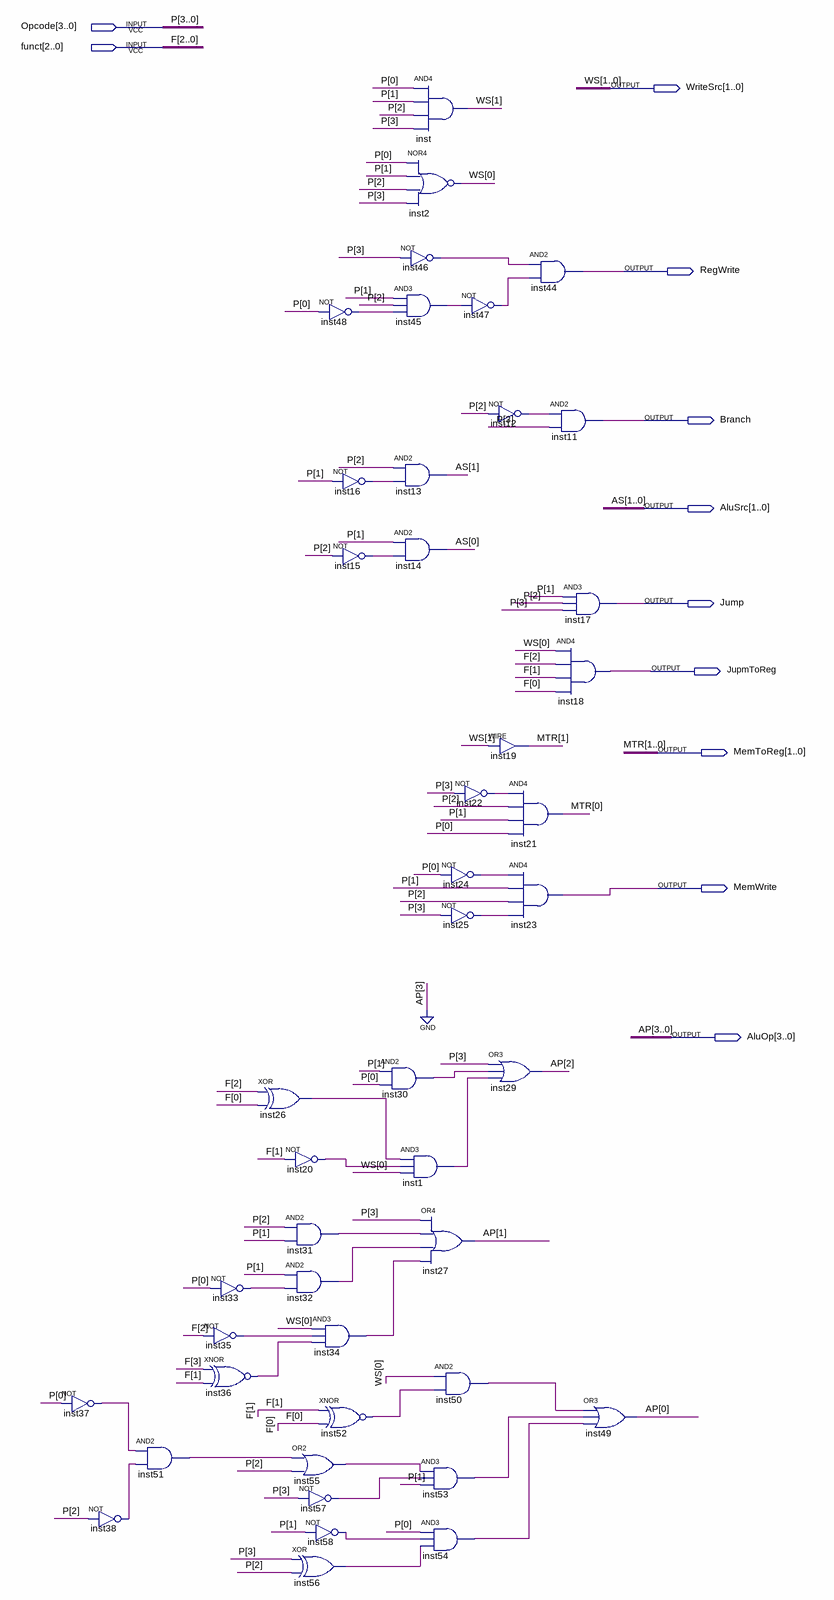
[diagram p0: schematic sheet]
// Quartus schematic ControlUnit.bdf as structural Verilog: 45 symbols, 11 pins
module ControlUnit (
  input  [3:0] Opcode,
  input  [2:0] funct,
  output [1:0] WriteSrc,
  output RegWrite,
  output Branch,
  output [1:0] AluSrc,
  output Jump,
  output JupmToReg,
  output [1:0] MemToReg,
  output MemWrite,
  output [3:0] AluOp
);

  wire inst1_out, inst12_out, inst15_out, inst16_out, inst20_out, inst22_out, inst24_out, inst25_out,
       inst26_out, inst30_out, inst31_out, inst32_out, inst33_out, inst34_out, inst35_out, inst36_out,
       inst37_out, inst38_out, inst45_out, inst46_out, inst47_out, inst48_out, inst50_out, inst51_out,
       inst52_out, inst53_out, inst54_out, inst55_out, inst56_out, inst57_out, inst58_out;
  wire [3:3] F;

  not inst37 (inst37_out, Opcode[0]);
  not inst38 (inst38_out, Opcode[2]);
  and inst51 (inst51_out, inst37_out, inst38_out);
  not inst33 (inst33_out, Opcode[0]);
  not inst35 (inst35_out, funct[2]);
  xnor inst36 (inst36_out, F[3], funct[1]);
  xor inst26 (inst26_out, funct[2], funct[0]);
  not inst20 (inst20_out, funct[1]);
  and inst31 (inst31_out, Opcode[2], Opcode[1]);
  and inst32 (inst32_out, Opcode[1], inst33_out);
  or inst55 (inst55_out, inst51_out, Opcode[2]);
  xor inst56 (inst56_out, Opcode[3], Opcode[2]);
  not inst48 (inst48_out, Opcode[0]);
  not inst16 (inst16_out, Opcode[1]);
  not inst15 (inst15_out, Opcode[2]);
  and inst34 (inst34_out, WriteSrc[0], inst35_out, inst36_out);
  xnor inst52 (inst52_out, funct[1], funct[0]);
  not inst57 (inst57_out, Opcode[3]);
  not inst58 (inst58_out, Opcode[1]);
  not inst46 (inst46_out, Opcode[3]);
  and inst45 (inst45_out, Opcode[1], Opcode[2], inst48_out);
  and inst13 (AluSrc[1], Opcode[2], inst16_out);
  and inst14 (AluSrc[0], Opcode[1], inst15_out);
  and inst30 (inst30_out, Opcode[1], Opcode[0]);
  and inst1 (inst1_out, inst26_out, inst20_out, WriteSrc[0]);
  and inst (WriteSrc[1], Opcode[0], Opcode[1], Opcode[2], Opcode[3]);
  nor inst2 (WriteSrc[0], Opcode[0], Opcode[1], Opcode[2], Opcode[3]);
  not inst22 (inst22_out, Opcode[3]);
  not inst24 (inst24_out, Opcode[0]);
  not inst25 (inst25_out, Opcode[3]);
  or inst27 (AluOp[1], Opcode[3], inst31_out, inst32_out, inst34_out);
  and inst50 (inst50_out, WriteSrc[0], inst52_out);
  and inst53 (inst53_out, inst55_out, inst57_out, Opcode[1]);
  and inst54 (inst54_out, Opcode[0], inst58_out, inst56_out);
  not inst47 (inst47_out, inst45_out);
  not inst12 (inst12_out, Opcode[2]);
  assign MemToReg[1] = WriteSrc[1];  // WIRE inst19
  and inst21 (MemToReg[0], inst22_out, Opcode[2], Opcode[1], Opcode[0]);
  and inst23 (MemWrite, inst24_out, Opcode[1], Opcode[2], inst25_out);
  or inst29 (AluOp[2], Opcode[3], inst30_out, inst1_out);
  and inst44 (RegWrite, inst46_out, inst47_out);
  and inst11 (Branch, inst12_out, Opcode[3]);
  and inst17 (Jump, Opcode[1], Opcode[2], Opcode[3]);
  and inst18 (JupmToReg, WriteSrc[0], funct[2], funct[1], funct[0]);
  or inst49 (AluOp[0], inst50_out, inst53_out, inst54_out);

  assign AluOp[3] = 1'b0;

  // Other names for the same wires on the sheet: AP[2:0] = AluOp[2:0]; AS[1:0] = AluSrc; F[2:0] = funct;
  //   MTR[1:0] = MemToReg; P[3:0] = Opcode; WS[1:0] = WriteSrc
endmodule
